# EAGLE schematic experimentboard (EAGLE 7.7.0)
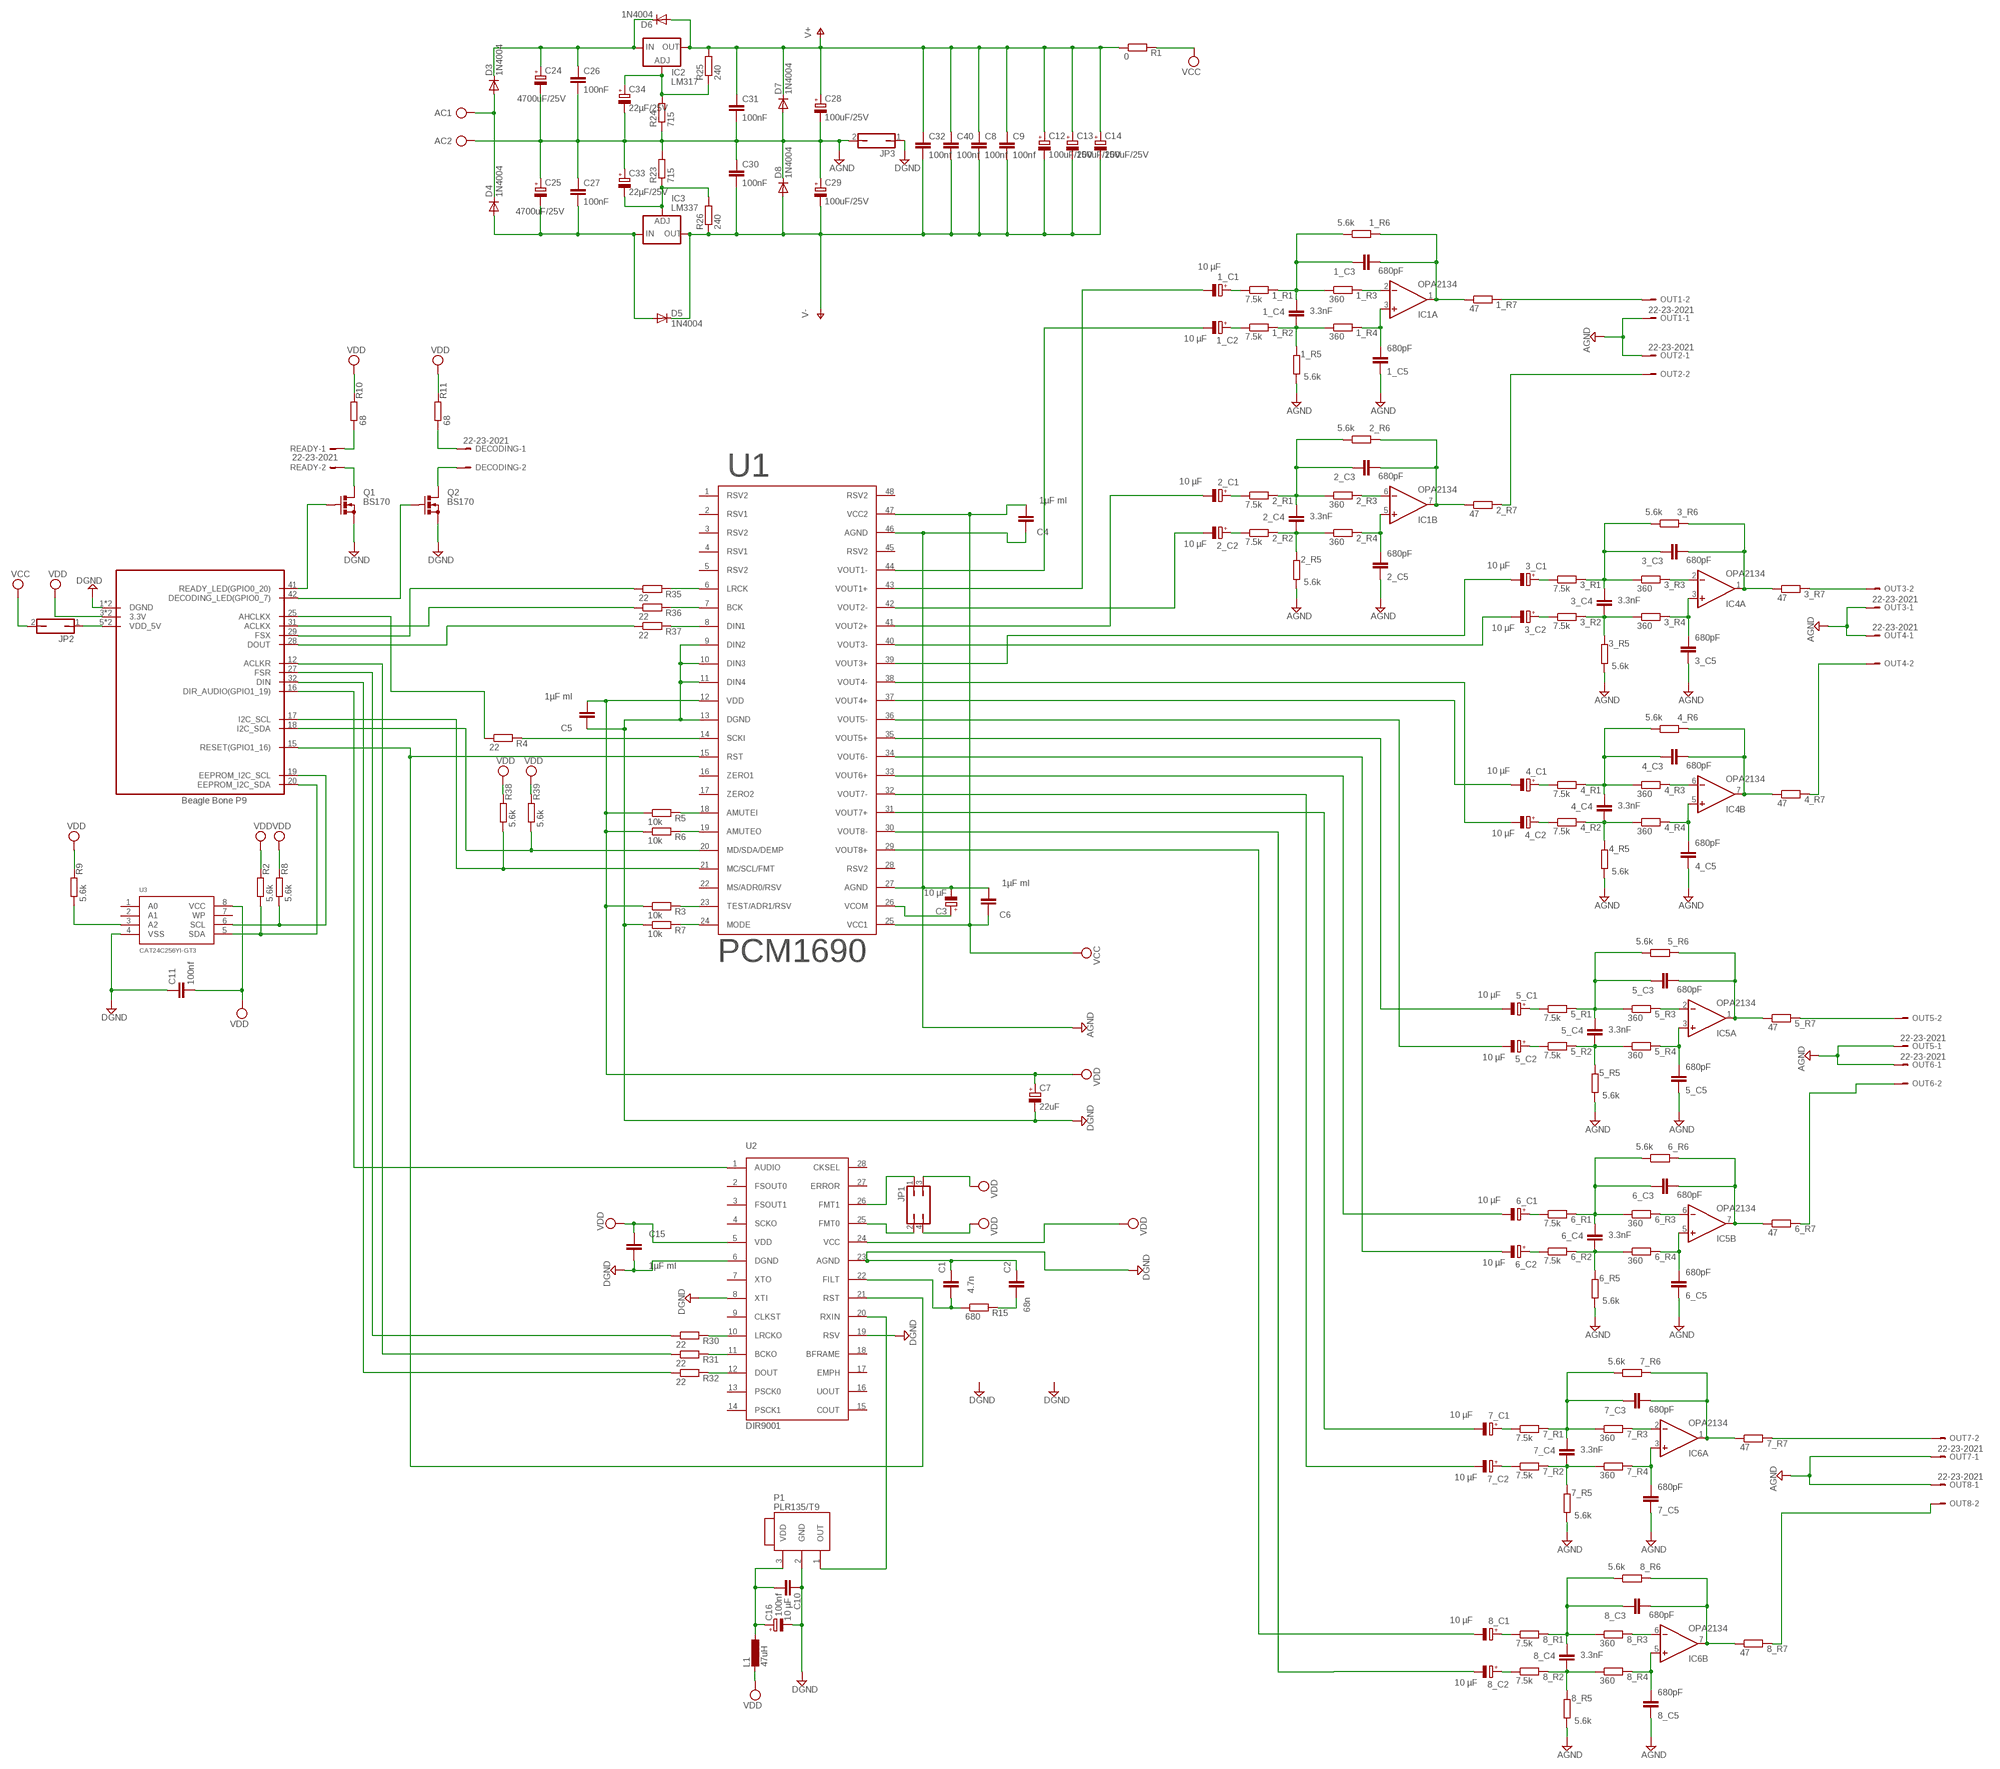
[diagram p0: schematic, sheet 1]

## Parts
1_C1  10 µF  CPOL-EUE2-5  [E2-5]
1_C2  10 µF  CPOL-EUE2-5  [E2-5]
1_C3  680pF  C-EU050-024X044  [C050-024X044]
1_C4  3.3nF  C-EU050-025X075  [C050-025X075]
1_C5  680pF  C-EU050-024X044  [C050-024X044]
1_R1  7.5k  R-EU_0207/7  [0207/7]
1_R2  7.5k  R-EU_0207/7  [0207/7]
1_R3  360  R-EU_0207/7  [0207/7]
1_R4  360  R-EU_0207/7  [0207/7]
1_R5  5.6k  R-EU_0207/7  [0207/7]
1_R6  5.6k  R-EU_0207/7  [0207/7]
1_R7  47  R-EU_0207/7  [0207/7]
2_C1  10 µF  CPOL-EUE2-5  [E2-5]
2_C2  10 µF  CPOL-EUE2-5  [E2-5]
2_C3  680pF  C-EU050-024X044  [C050-024X044]
2_C4  3.3nF  C-EU050-025X075  [C050-025X075]
2_C5  680pF  C-EU050-024X044  [C050-024X044]
2_R1  7.5k  R-EU_0207/7  [0207/7]
2_R2  7.5k  R-EU_0207/7  [0207/7]
2_R3  360  R-EU_0207/7  [0207/7]
2_R4  360  R-EU_0207/7  [0207/7]
2_R5  5.6k  R-EU_0207/7  [0207/7]
2_R6  5.6k  R-EU_0207/7  [0207/7]
2_R7  47  R-EU_0207/7  [0207/7]
3_C1  10 µF  CPOL-EUE2-5  [E2-5]
3_C2  10 µF  CPOL-EUE2-5  [E2-5]
3_C3  680pF  C-EU050-024X044  [C050-024X044]
3_C4  3.3nF  C-EU050-025X075  [C050-025X075]
3_C5  680pF  C-EU050-024X044  [C050-024X044]
3_R1  7.5k  R-EU_0207/7  [0207/7]
3_R2  7.5k  R-EU_0207/7  [0207/7]
3_R3  360  R-EU_0207/7  [0207/7]
3_R4  360  R-EU_0207/7  [0207/7]
3_R5  5.6k  R-EU_0207/7  [0207/7]
3_R6  5.6k  R-EU_0207/7  [0207/7]
3_R7  47  R-EU_0207/7  [0207/7]
4_C1  10 µF  CPOL-EUE2-5  [E2-5]
4_C2  10 µF  CPOL-EUE2-5  [E2-5]
4_C3  680pF  C-EU050-024X044  [C050-024X044]
4_C4  3.3nF  C-EU050-025X075  [C050-025X075]
4_C5  680pF  C-EU050-024X044  [C050-024X044]
4_R1  7.5k  R-EU_0207/7  [0207/7]
4_R2  7.5k  R-EU_0207/7  [0207/7]
4_R3  360  R-EU_0207/7  [0207/7]
4_R4  360  R-EU_0207/7  [0207/7]
4_R5  5.6k  R-EU_0207/7  [0207/7]
4_R6  5.6k  R-EU_0207/7  [0207/7]
4_R7  47  R-EU_0207/7  [0207/7]
5_C1  10 µF  CPOL-EUE2-5  [E2-5]
5_C2  10 µF  CPOL-EUE2-5  [E2-5]
5_C3  680pF  C-EU050-024X044  [C050-024X044]
5_C4  3.3nF  C-EU050-025X075  [C050-025X075]
5_C5  680pF  C-EU050-024X044  [C050-024X044]
5_R1  7.5k  R-EU_0207/7  [0207/7]
5_R2  7.5k  R-EU_0207/7  [0207/7]
5_R3  360  R-EU_0207/7  [0207/7]
5_R4  360  R-EU_0207/7  [0207/7]
5_R5  5.6k  R-EU_0207/7  [0207/7]
5_R6  5.6k  R-EU_0207/7  [0207/7]
5_R7  47  R-EU_0207/7  [0207/7]
6_C1  10 µF  CPOL-EUE2-5  [E2-5]
6_C2  10 µF  CPOL-EUE2-5  [E2-5]
6_C3  680pF  C-EU050-024X044  [C050-024X044]
6_C4  3.3nF  C-EU050-025X075  [C050-025X075]
6_C5  680pF  C-EU050-024X044  [C050-024X044]
6_R1  7.5k  R-EU_0207/7  [0207/7]
6_R2  7.5k  R-EU_0207/7  [0207/7]
6_R3  360  R-EU_0207/7  [0207/7]
6_R4  360  R-EU_0207/7  [0207/7]
6_R5  5.6k  R-EU_0207/7  [0207/7]
6_R6  5.6k  R-EU_0207/7  [0207/7]
6_R7  47  R-EU_0207/7  [0207/7]
7_C1  10 µF  CPOL-EUE2-5  [E2-5]
7_C2  10 µF  CPOL-EUE2-5  [E2-5]
7_C3  680pF  C-EU050-024X044  [C050-024X044]
7_C4  3.3nF  C-EU050-025X075  [C050-025X075]
7_C5  680pF  C-EU050-024X044  [C050-024X044]
7_R1  7.5k  R-EU_0207/7  [0207/7]
7_R2  7.5k  R-EU_0207/7  [0207/7]
7_R3  360  R-EU_0207/7  [0207/7]
7_R4  360  R-EU_0207/7  [0207/7]
7_R5  5.6k  R-EU_0207/7  [0207/7]
7_R6  5.6k  R-EU_0207/7  [0207/7]
7_R7  47  R-EU_0207/7  [0207/7]
8_C1  10 µF  CPOL-EUE2-5  [E2-5]
8_C2  10 µF  CPOL-EUE2-5  [E2-5]
8_C3  680pF  C-EU050-024X044  [C050-024X044]
8_C4  3.3nF  C-EU050-025X075  [C050-025X075]
8_C5  680pF  C-EU050-024X044  [C050-024X044]
8_R1  7.5k  R-EU_0207/7  [0207/7]
8_R2  7.5k  R-EU_0207/7  [0207/7]
8_R3  360  R-EU_0207/7  [0207/7]
8_R4  360  R-EU_0207/7  [0207/7]
8_R5  5.6k  R-EU_0207/7  [0207/7]
8_R6  5.6k  R-EU_0207/7  [0207/7]
8_R7  47  R-EU_0207/7  [0207/7]
AC  ADAPTER-PLUG-5.5MM  [ADAPTER-PLUG-5.5MM]
C1  4.7n  C-EU050-024X044  [C050-024X044]
C2  68n  C-EU050-024X044  [C050-024X044]
C3  10 µF  CPOL-EUE2-5  [E2-5]
C4  1µF ml  C-EU050-024X044  [C050-024X044]
C5  1µF ml  C-EU050-024X044  [C050-024X044]
C6  1µF ml  C-EU050-024X044  [C050-024X044]
C7  22uF  CPOL-EUE2-5  [E2-5]
C8  100nf  C-EU050-024X044  [C050-024X044]
C9  100nf  C-EU050-024X044  [C050-024X044]
C10  100nf  C-EU050-024X044  [C050-024X044]
C11  100nf  C-EU050-024X044  [C050-024X044]
C12  100uF/25V  CPOL-EUE2.5-6  [E2,5-6]
C13  100uF/25V  CPOL-EUE2.5-6  [E2,5-6]
C14  100uF/25V  CPOL-EUE2.5-6  [E2,5-6]
C15  1µF ml  C-EU050-024X044  [C050-024X044]
C16  10 µF  CPOL-EUE2-5  [E2-5]
C24  4700uF/25V  CPOL-EUE7.5-16  [E7,5-16]
C25  4700uF/25V  CPOL-EUE7.5-16  [E7,5-16]
C26  100nF  C-EU050-024X044  [C050-024X044]
C27  100nF  C-EU050-024X044  [C050-024X044]
C28  100uF/25V  CPOL-EUE2.5-6  [E2,5-6]
C29  100uF/25V  CPOL-EUE2.5-6  [E2,5-6]
C30  100nF  C-EU050-024X044  [C050-024X044]
C31  100nF  C-EU050-024X044  [C050-024X044]
C32  100nf  C-EU050-024X044  [C050-024X044]
C33  22µF/25V  CPOL-EUE2.5-6  [E2,5-6]
C34  22µF/25V  CPOL-EUE2.5-6  [E2,5-6]
C40  100nf  C-EU050-024X044  [C050-024X044]
D3  1N4004  DIODE-DO41-7.6  [DO41-7.6]
D4  1N4004  DIODE-DO41-7.6  [DO41-7.6]
D5  1N4004  DIODE-DO41-7.6  [DO41-7.6]
D6  1N4004  DIODE-DO41-7.6  [DO41-7.6]
D7  1N4004  DIODE-DO41-7.6  [DO41-7.6]
D8  1N4004  DIODE-DO41-7.6  [DO41-7.6]
DECODING  22-23-2021  [22-23-2021]
IC1  OPA2134  TL072P  [DIL8]
IC2  LM317  LM317TS  [317TS]
IC3  LM337  LM337TS  [337TS]
IC4  OPA2134  TL072P  [DIL8]
IC5  OPA2134  TL072P  [DIL8]
IC6  OPA2134  TL072P  [DIL8]
JP1  JP2Q  [JP2Q]
JP2  JP1Q  [JP1]
JP3  JP1Q  [JP1]
L1  47uH  L-EU0207/10  [0207/10]
OUT1  22-23-2021  [22-23-2021]
OUT2  22-23-2021  [22-23-2021]
OUT3  22-23-2021  [22-23-2021]
OUT4  22-23-2021  [22-23-2021]
OUT5  22-23-2021  [22-23-2021]
OUT6  22-23-2021  [22-23-2021]
OUT7  22-23-2021  [22-23-2021]
OUT8  22-23-2021  [22-23-2021]
P1  PLR135/T9  [PLR135/T9]
P9  P9  BEAGLEBONEP9  [HEADERS23-2]
Q1  BS170  [SOT54E]
Q2  BS170  [SOT54E]
R1  0  R-EU_0204/2V  [0204V]
R2  5.6k  R-EU_0207/7  [0207/7]
R3  10k  R-EU_0207/7  [0207/7]
R4  22  R-EU_0207/7  [0207/7]
R5  10k  R-EU_0207/7  [0207/7]
R6  10k  R-EU_0207/7  [0207/7]
R7  10k  R-EU_0207/7  [0207/7]
R8  5.6k  R-EU_0207/7  [0207/7]
R9  5.6k  R-EU_0207/7  [0207/7]
R10  68  R-EU_0204/2V  [0204V]
R11  68  R-EU_0204/2V  [0204V]
R15  680  R-EU_0207/7  [0207/7]
R23  715  R-EU_0207/10  [0207/10]
R24  715  R-EU_0207/10  [0207/10]
R25  240  R-EU_0207/10  [0207/10]
R26  240  R-EU_0207/10  [0207/10]
R30  22  R-EU_0207/7  [0207/7]
R31  22  R-EU_0207/7  [0207/7]
R32  22  R-EU_0207/7  [0207/7]
R35  22  R-EU_0207/7  [0207/7]
R36  22  R-EU_0207/7  [0207/7]
R37  22  R-EU_0207/7  [0207/7]
R38  5.6k  R-EU_0207/7  [0207/7]
R39  5.6k  R-EU_0207/7  [0207/7]
READY  22-23-2021  [22-23-2021]
U1  PCM1690  [HTSSOP48DFD]
U2  DIR9001  [TSSOP28]
U3  CAT24C256YI-GT3  [TSSOP8]

## Nets
ACLKR: P9.12(ACLKR) R31.1
ACLKX: P9.31(ACLKX) R36.1
AGND: 1_C5.1 1_R5.1 2_C5.1 2_R5.1 3_C5.1 3_R5.1 4_C5.1 4_R5.1 5_C5.1 5_R5.1 6_C5.1 6_R5.1 7_C5.1 7_R5.1 8_C5.1 8_R5.1 AC.3 C3.- C4.1 C6.2 C24.- C25.+ C26.2 C27.1 C28.- C29.+ C30.1 C31.2 C33.+ C34.- D7.A D8.C JP3.2 OUT1.1 OUT2.1 OUT3.1 OUT4.1 OUT5.1 OUT6.1 OUT7.1 OUT8.1 R23.2 R24.1 U1.27(AGND) U1.46(AGND)
AHCLKX: P9.29(FSX) R35.1
CAPE_I2C_SCL: P9.19(EEPROM_I2C_SCL) R8.1 U3.6(SCL)
CAPE_I2C_SDA: P9.20(EEPROM_I2C_SDA) R2.1 U3.5(SDA)
DGND: C1.1 C2.1 C5.1 C7.- C10.1 C11.1 C15.2 C16.- JP3.1 P1.2(GND) P9.1(DGND) P9.2(DGND) Q1.S Q2.S R7.1 U1.9(DIN2) U1.10(DIN3) U1.11(DIN4) U1.13(DGND) U2.6(DGND) U2.8(XTI) U2.19(RSV) U2.23(AGND) U3.4(VSS)
DIN: P9.32(DIN) R32.1
DIR_AUDIO: P9.16(DIR_AUDIO(GPIO1_19)) U2.1(AUDIO)
DOUT: P9.28(DOUT) R37.1
FILT: C1.2 R15.1 U2.22(FILT)
FSR: P9.27(FSR) R30.1
MCLK: P9.25(AHCLKX) R4.1
N$2: R3.2 U1.23(TEST/ADR1/RSV)
N$4: Q1.D READY.2
N$5: R4.2 U1.14(SCKI)
N$6: C2.2 R15.2
N$7: JP1.2 U2.25(FMT0)
N$8: JP1.1 U2.26(FMT1)
N$9: 3_C4.1 3_R2.2 3_R4.1 3_R5.2
N$10: 3_C3.1 3_C4.2 3_R1.2 3_R3.1 3_R6.1
N$11: R5.2 U1.18(AMUTEI)
N$12: C10.2 C16.+ L1.1 P1.3(VDD)
N$13: 1_C4.1 1_R2.2 1_R4.1 1_R5.2
N$14: 2_C4.1 2_R2.2 2_R4.1 2_R5.2
N$15: 2_C3.1 2_C4.2 2_R1.2 2_R3.1 2_R6.1
N$16: 3_C5.2 3_R4.2 IC4.3(A:+IN)
N$17: R6.2 U1.19(AMUTEO)
N$18: 1_C3.1 1_C4.2 1_R1.2 1_R3.1 1_R6.1
N$19: R7.2 U1.24(MODE)
N$20: P1.1(OUT) U2.20(RXIN)
N$21: 3_C3.2 3_R6.2 3_R7.1 IC4.1(A:OUT)
N$22: 3_R3.2 IC4.2(A:-IN)
N$23: 1_R3.2 IC1.2(A:-IN)
N$24: 1_C5.2 1_R4.2 IC1.3(A:+IN)
N$25: 1_C2.+ 1_R2.1
N$26: 1_C3.2 1_R6.2 1_R7.1 IC1.1(A:OUT)
N$27: 1_C1.+ 1_R1.1
N$28: R10.1 READY.1
N$29: 7_C4.1 7_R2.2 7_R4.1 7_R5.2
N$30: 2_C5.2 2_R4.2 IC1.5(B:+IN)
N$31: 2_C3.2 2_R6.2 2_R7.1 IC1.7(B:OUT)
N$32: 2_R3.2 IC1.6(B:-IN)
N$33: 2_C2.+ 2_R2.1
N$34: 2_C1.+ 2_R1.1
N$35: 7_C3.1 7_C4.2 7_R1.2 7_R3.1 7_R6.1
N$36: 7_C5.2 7_R4.2 IC6.3(A:+IN)
N$37: 1_R7.2 OUT1.2
N$38: 2_R7.2 OUT2.2
N$39: C24.+ C26.1 D3.C D6.C IC2.3(IN)
N$40: AC.1 D3.A D4.C
N$41: C25.- C27.2 D4.A D5.A IC3.2(IN)
N$42: C33.- IC3.1(ADJ) R23.1 R26.2
N$43: C34.+ IC2.1(ADJ) R24.2 R25.1
N$44: 3_C2.+ 3_R2.1
N$45: 3_C1.+ 3_R1.1
N$46: 7_C3.2 7_R6.2 7_R7.1 IC6.1(A:OUT)
N$47: 7_R3.2 IC6.2(A:-IN)
N$48: 4_C4.1 4_R2.2 4_R4.1 4_R5.2
N$49: 4_C3.1 4_C4.2 4_R1.2 4_R3.1 4_R6.1
N$50: 4_C5.2 4_R4.2 IC4.5(B:+IN)
N$51: R32.2 U2.12(DOUT)
N$52: R31.2 U2.11(BCKO)
N$53: R30.2 U2.10(LRCKO)
N$54: R9.1 U3.3(A2)
N$55: 4_C3.2 4_R6.2 4_R7.1 IC4.7(B:OUT)
N$56: 4_R3.2 IC4.6(B:-IN)
N$57: 4_C2.+ 4_R2.1
N$58: 4_C1.+ 4_R1.1
N$59: 7_C2.+ 7_R2.1
N$60: 7_C1.+ 7_R1.1
N$61: R37.2 U1.8(DIN1)
N$62: R36.2 U1.7(BCK)
N$63: R35.2 U1.6(LRCK)
N$64: 3_R7.2 OUT3.2
N$65: 4_R7.2 OUT4.2
N$66: 5_C4.1 5_R2.2 5_R4.1 5_R5.2
N$67: 5_C3.1 5_C4.2 5_R1.2 5_R3.1 5_R6.1
N$68: 5_C5.2 5_R4.2 IC5.3(A:+IN)
N$69: 5_C3.2 5_R6.2 5_R7.1 IC5.1(A:OUT)
N$70: 5_R3.2 IC5.2(A:-IN)
N$71: 5_C2.+ 5_R2.1
N$72: 5_C1.+ 5_R1.1
N$73: 8_C4.1 8_R2.2 8_R4.1 8_R5.2
N$74: 8_C3.1 8_C4.2 8_R1.2 8_R3.1 8_R6.1
N$75: 6_C4.1 6_R2.2 6_R4.1 6_R5.2
N$76: 6_C3.1 6_C4.2 6_R1.2 6_R3.1 6_R6.1
N$77: 6_C5.2 6_R4.2 IC5.5(B:+IN)
N$78: 6_C3.2 6_R6.2 6_R7.1 IC5.7(B:OUT)
N$79: 6_R3.2 IC5.6(B:-IN)
N$80: 6_C2.+ 6_R2.1
N$81: 6_C1.+ 6_R1.1
N$82: 5_R7.2 OUT5.2
N$83: 6_R7.2 OUT6.2
N$84: 8_C5.2 8_R4.2 IC6.5(B:+IN)
N$85: 8_C3.2 8_R6.2 8_R7.1 IC6.7(B:OUT)
N$86: 8_R3.2 IC6.6(B:-IN)
N$87: 8_C2.+ 8_R2.1
N$88: 8_C1.+ 8_R1.1
N$89: 7_R7.2 OUT7.2
N$90: 8_R7.2 OUT8.2
N$91: DECODING.2 Q2.D
N$92: DECODING.1 R11.1
N$93: P9.41(READY_LED(GPIO0_20)) Q1.G
N$94: P9.42(DECODING_LED(GPIO0_7)) Q2.G
RST: P9.15(RESET(GPIO1_16)) U1.15(RST) U2.21(RST)
SCL: P9.17(I2C_SCL) R38.1 U1.21(MC/SCL/FMT)
SDA: P9.18(I2C_SDA) R39.1 U1.20(MD/SDA/DEMP)
V+: C8.1 C9.1 C12.+ C13.+ C14.+ C28.+ C31.1 C32.1 C40.1 D6.A D7.C IC2.2(OUT) R1.1 R25.2
V-: C8.2 C9.2 C12.- C13.- C14.- C29.- C30.2 C32.2 C40.2 D5.C D8.A IC3.3(OUT) R26.1
VCC: C4.2 C6.1 JP2.2 R1.2 U1.25(VCC1) U1.47(VCC2)
VCOM: C3.+ U1.26(VCOM)
VDD: C5.2 C7.+ C11.2 C15.1 JP1.3 JP1.4 L1.2 P9.3(3.3V) P9.4(3.3V) R2.2 R3.1 R5.1 R6.1 R8.2 R9.2 R10.2 R11.2 R38.2 R39.2 U1.12(VDD) U2.5(VDD) U2.24(VCC) U3.8(VCC)
VDD_5V: JP2.1 P9.5(VDD_5V) P9.6(VDD_5V)
VOUT1+: 1_C1.- U1.43(VOUT1+)
VOUT1-: 1_C2.- U1.44(VOUT1-)
VOUT2+: 2_C1.- U1.41(VOUT2+)
VOUT2-: 2_C2.- U1.42(VOUT2-)
VOUT3+: 3_C1.- U1.39(VOUT3+)
VOUT3-: 3_C2.- U1.40(VOUT3-)
VOUT4+: 4_C1.- U1.37(VOUT4+)
VOUT4-: 4_C2.- U1.38(VOUT4-)
VOUT5+: 5_C1.- U1.35(VOUT5+)
VOUT5-: 5_C2.- U1.36(VOUT5-)
VOUT6+: 6_C1.- U1.33(VOUT6+)
VOUT6-: 6_C2.- U1.34(VOUT6-)
VOUT7+: 7_C1.- U1.31(VOUT7+)
VOUT7-: 7_C2.- U1.32(VOUT7-)
VOUT8+: 8_C1.- U1.29(VOUT8+)
VOUT8-: 8_C2.- U1.30(VOUT8-)
Unconnected: U1.1(RSV2) U1.2(RSV1) U1.3(RSV2) U1.4(RSV1) U1.5(RSV2) U1.16(ZERO1) U1.17(ZERO2) U1.22(MS/ADR0/RSV) U1.28(RSV2) U1.45(RSV2) U1.48(RSV2) U2.2(FSOUT0) U2.3(FSOUT1) U2.4(SCKO) U2.7(XTO) U2.9(CLKST) U2.13(PSCK0) U2.14(PSCK1) U2.15(COUT) U2.16(UOUT) U2.17(EMPH) U2.18(BFRAME) U2.27(ERROR) U2.28(CKSEL) U3.1(A0) U3.2(A1) U3.7(WP)

## Power pins joined to a net without a drawn wire
V+: IC1.8(P:V+) IC4.8(P:V+) IC5.8(P:V+) IC6.8(P:V+)
V-: IC1.4(P:V-) IC4.4(P:V-) IC5.4(P:V-) IC6.4(P:V-)

## Library data of the parts
1_C1 1_C2 2_C1 2_C2 3_C1 3_C2 4_C1 4_C2 5_C1 5_C2 6_C1 6_C2 7_C1 7_C2 8_C1 8_C2 C3 C7 C12-C14 C16 C24 C25 C28 C29 C33 C34 = rcl:CPOL-EU: POLARIZED CAPACITOR, European symbol
1_C3-1_C5 2_C3-2_C5 3_C3-3_C5 4_C3-4_C5 5_C3-5_C5 6_C3-6_C5 7_C3-7_C5 8_C3-8_C5 C1 C2 C4-C6 C8-C11 C15 C26 C27 C30-C32 C40 = rcl:C-EU: CAPACITOR, European symbol
1_R1-1_R7 2_R1-2_R7 3_R1-3_R7 4_R1-4_R7 5_R1-5_R7 6_R1-6_R7 7_R1-7_R7 8_R1-8_R7 R1-R11 R15 R23-R26 R30-R32 R35-R39 = rcl:R-EU_: RESISTOR, European symbol
AC = 0000halfgaar:ADAPTER-PLUG-5.5MM: PCB mounted 5.5 mm adapter plug. As bought at Okaphone.
D3-D8 = diode:DIODE-: DIODE
DECODING OUT1-OUT8 READY = con-molex:22-23-2021: .100" (2.54mm) Center Header - 2 Pin; MF: MOLEX; MPN: 22-23-2021; OC_FARNELL: 1462926; OC_NEWARK: 25C3832
IC1 IC4-IC6 = 0000halfgaar:TL072: TL072 dual opamp
IC2 = v-reg:LM317TS: VOLTAGE REGULATOR
IC3 = v-reg:LM337TS: VOLTAGE REGULATOR
JP1 = jumper:JP2Q: JUMPER
JP2 JP3 = jumper:JP1Q: JUMPER
L1 = rcl:L-EU: INDUCTOR, European symbol
P1 = 0000halfgaar:PLR135/T9: PLR135/T9 Optical Receiver
P9 = 0000halfgaar:BEAGLEBONEP9: Beagle Bone green/black P9 I2s / mcasp function
Q1 Q2 = transistor-small-signal:BS170: N-CHANNEL MOS FET
U1 = 0000halfgaar:PCM1690: PLL1609 24-Bit, 192-kHz Sampling, Enhanced Multi-Level ΔΣ, Eight-Channel Audio Digital-to-Analog Converter
U2 = 0000halfgaar:DIR9001: DIR9001 DIR9001 Digital audio interface receiver
U3 = 0000halfgaar:CAT24C256: CAT24C256 EEPROM, the one the Beagle Bone Black wants